# EAGLE schematic headstage-neuropix-64 (EAGLE 9.4.2)
DESIGNER: JON NEWMAN, JAKOB VOIGTS; DESIGN_NAME: HEADSTAGE-64; LICENSE: CERN OHL v1.2; REVISION: 1.2
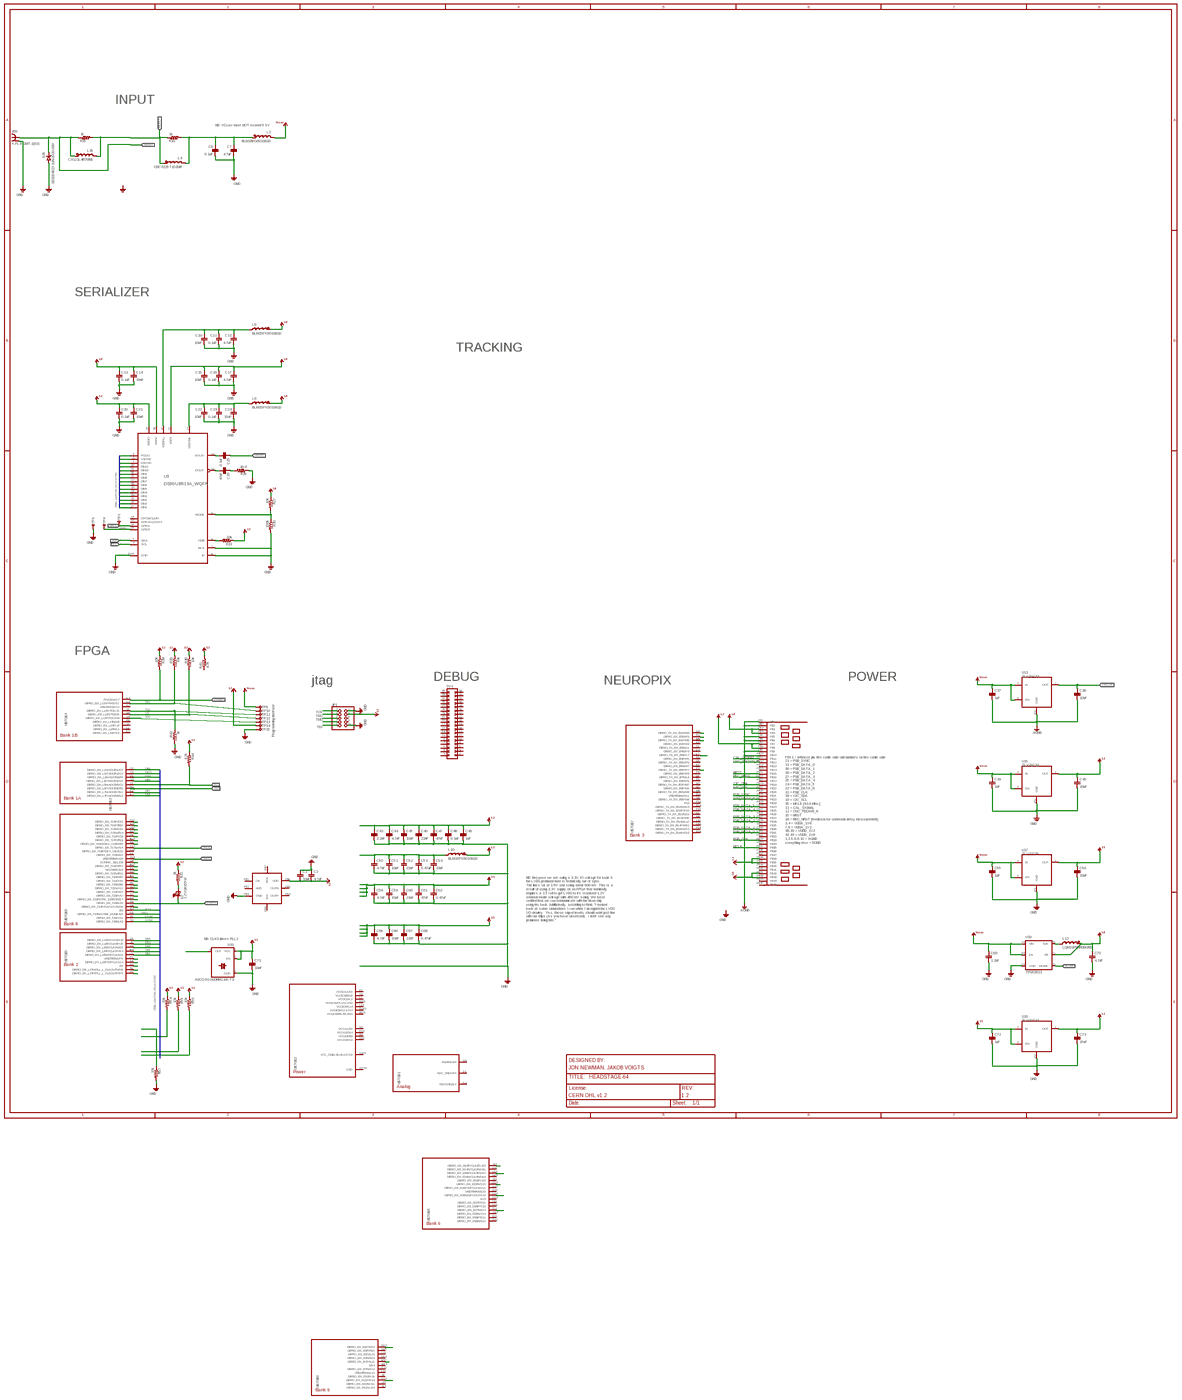
[diagram p0: schematic, sheet 1, overview]
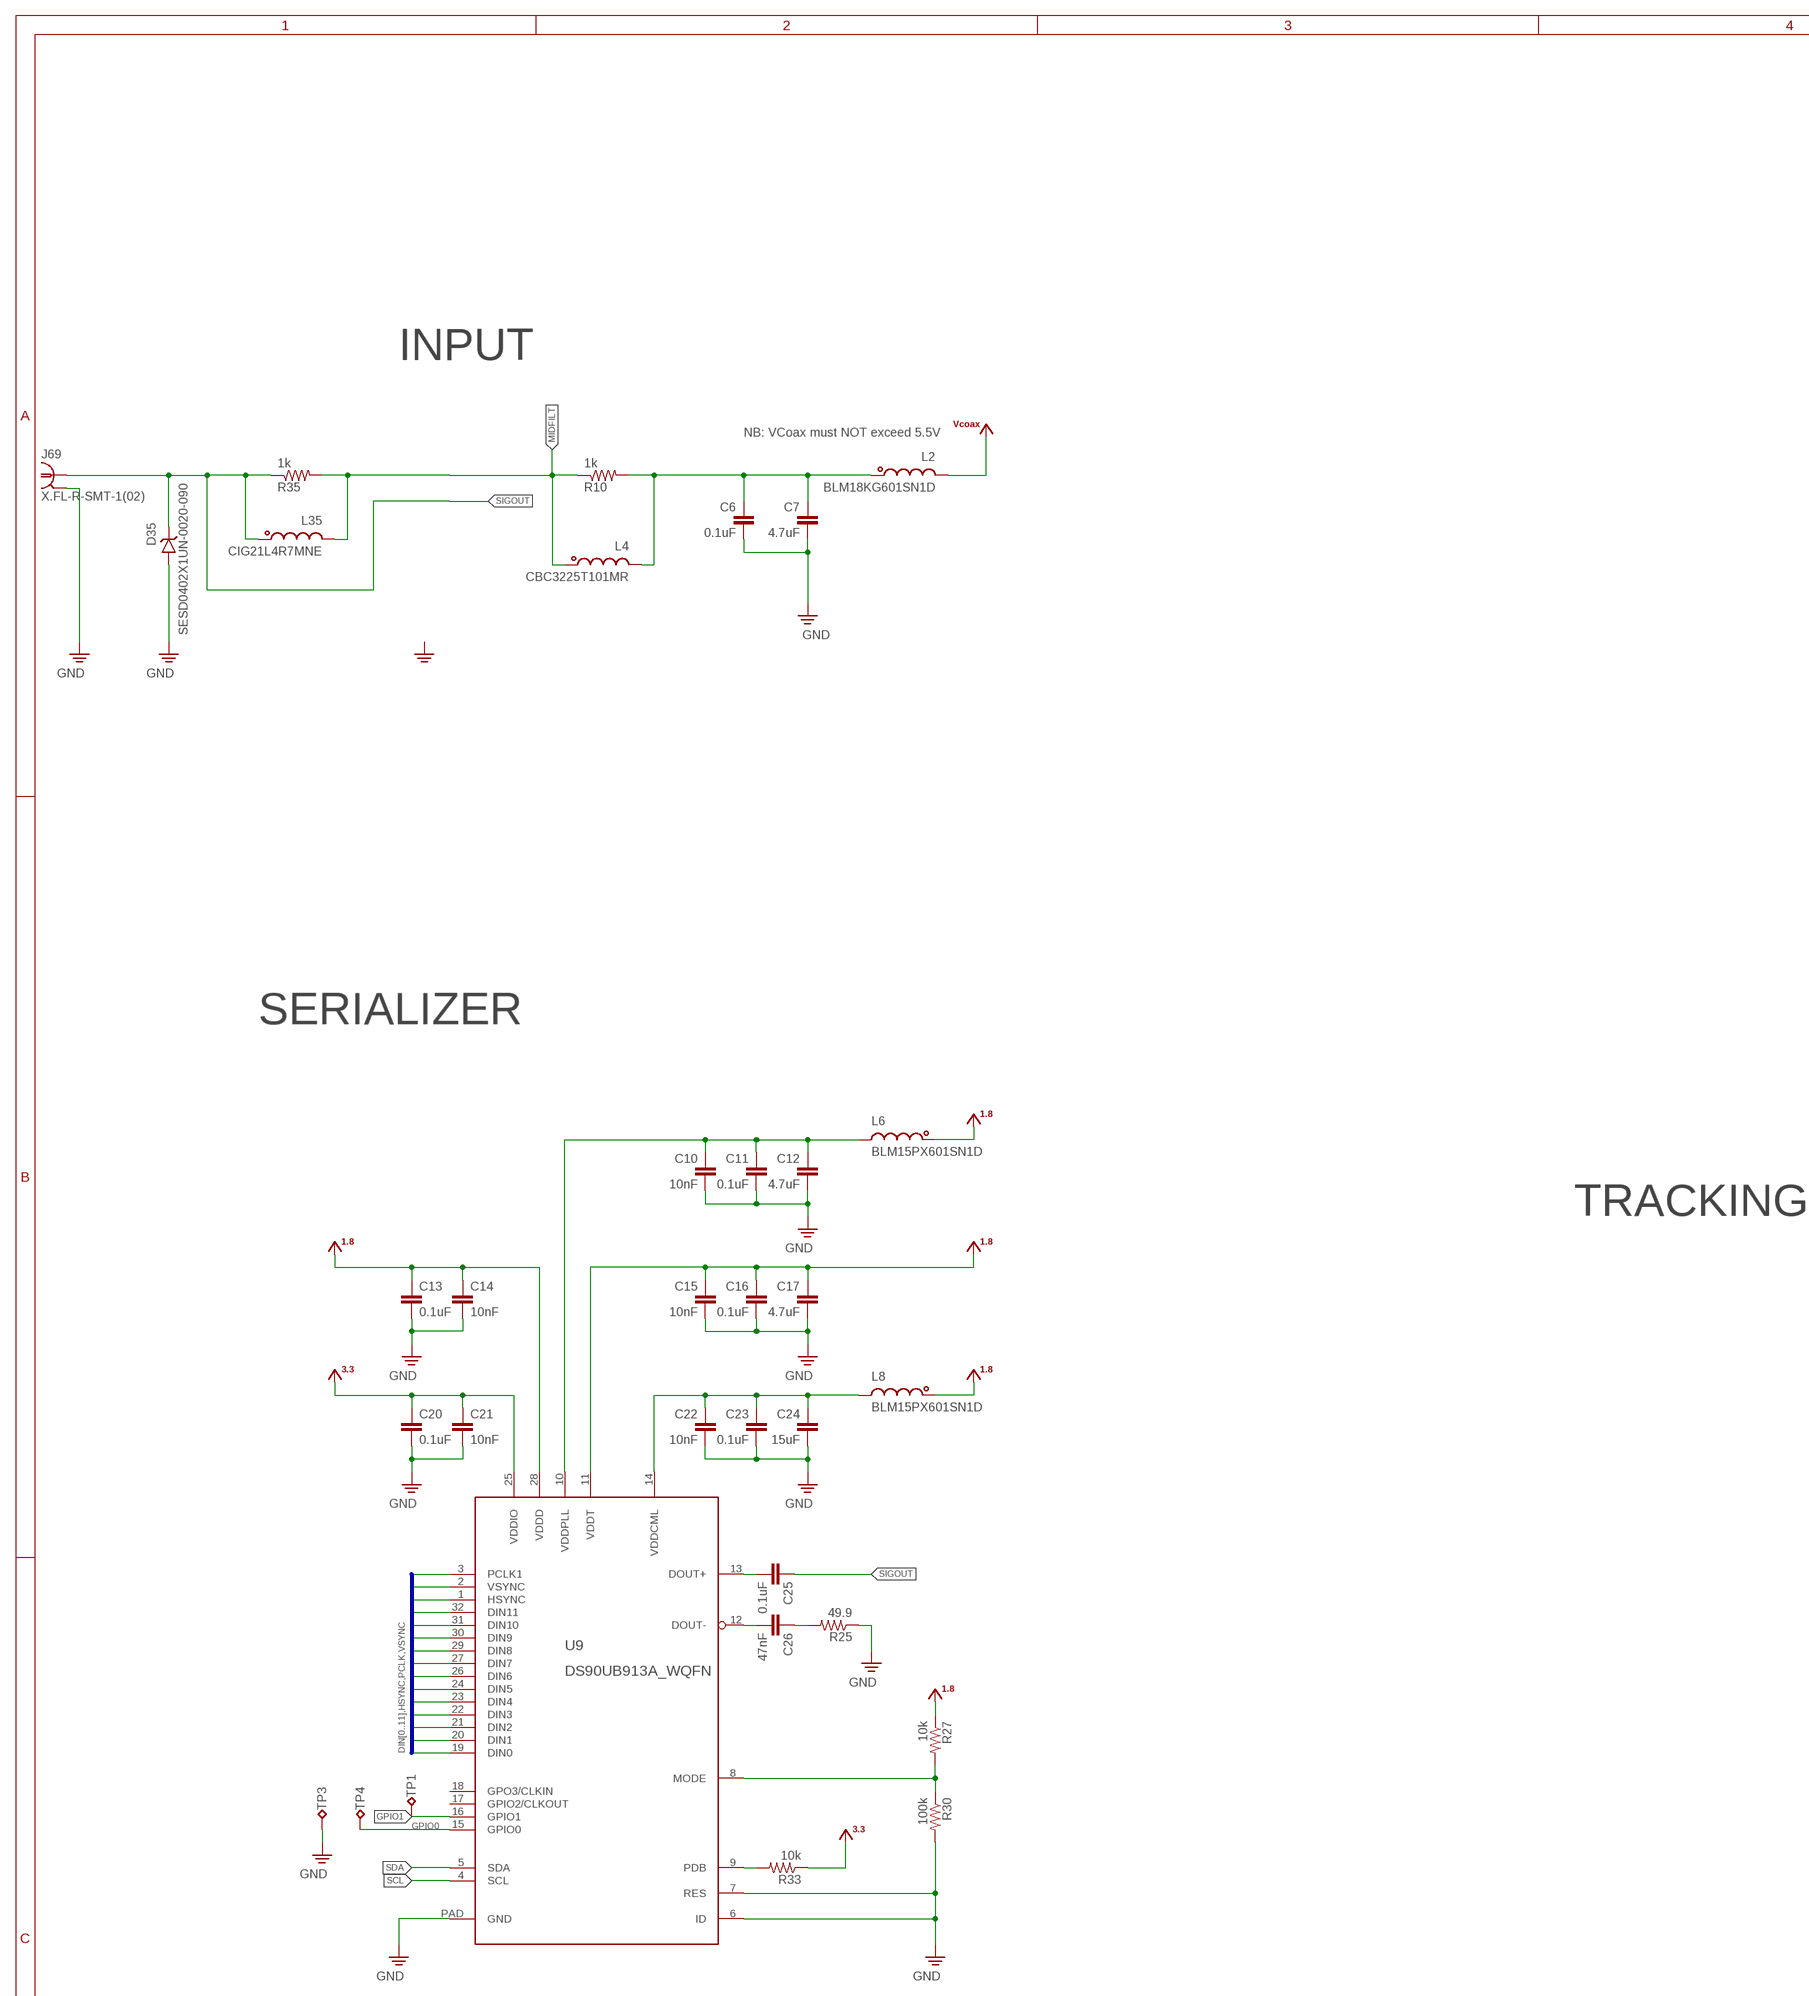
[diagram p1: schematic, sheet 1, part 1 of 5]
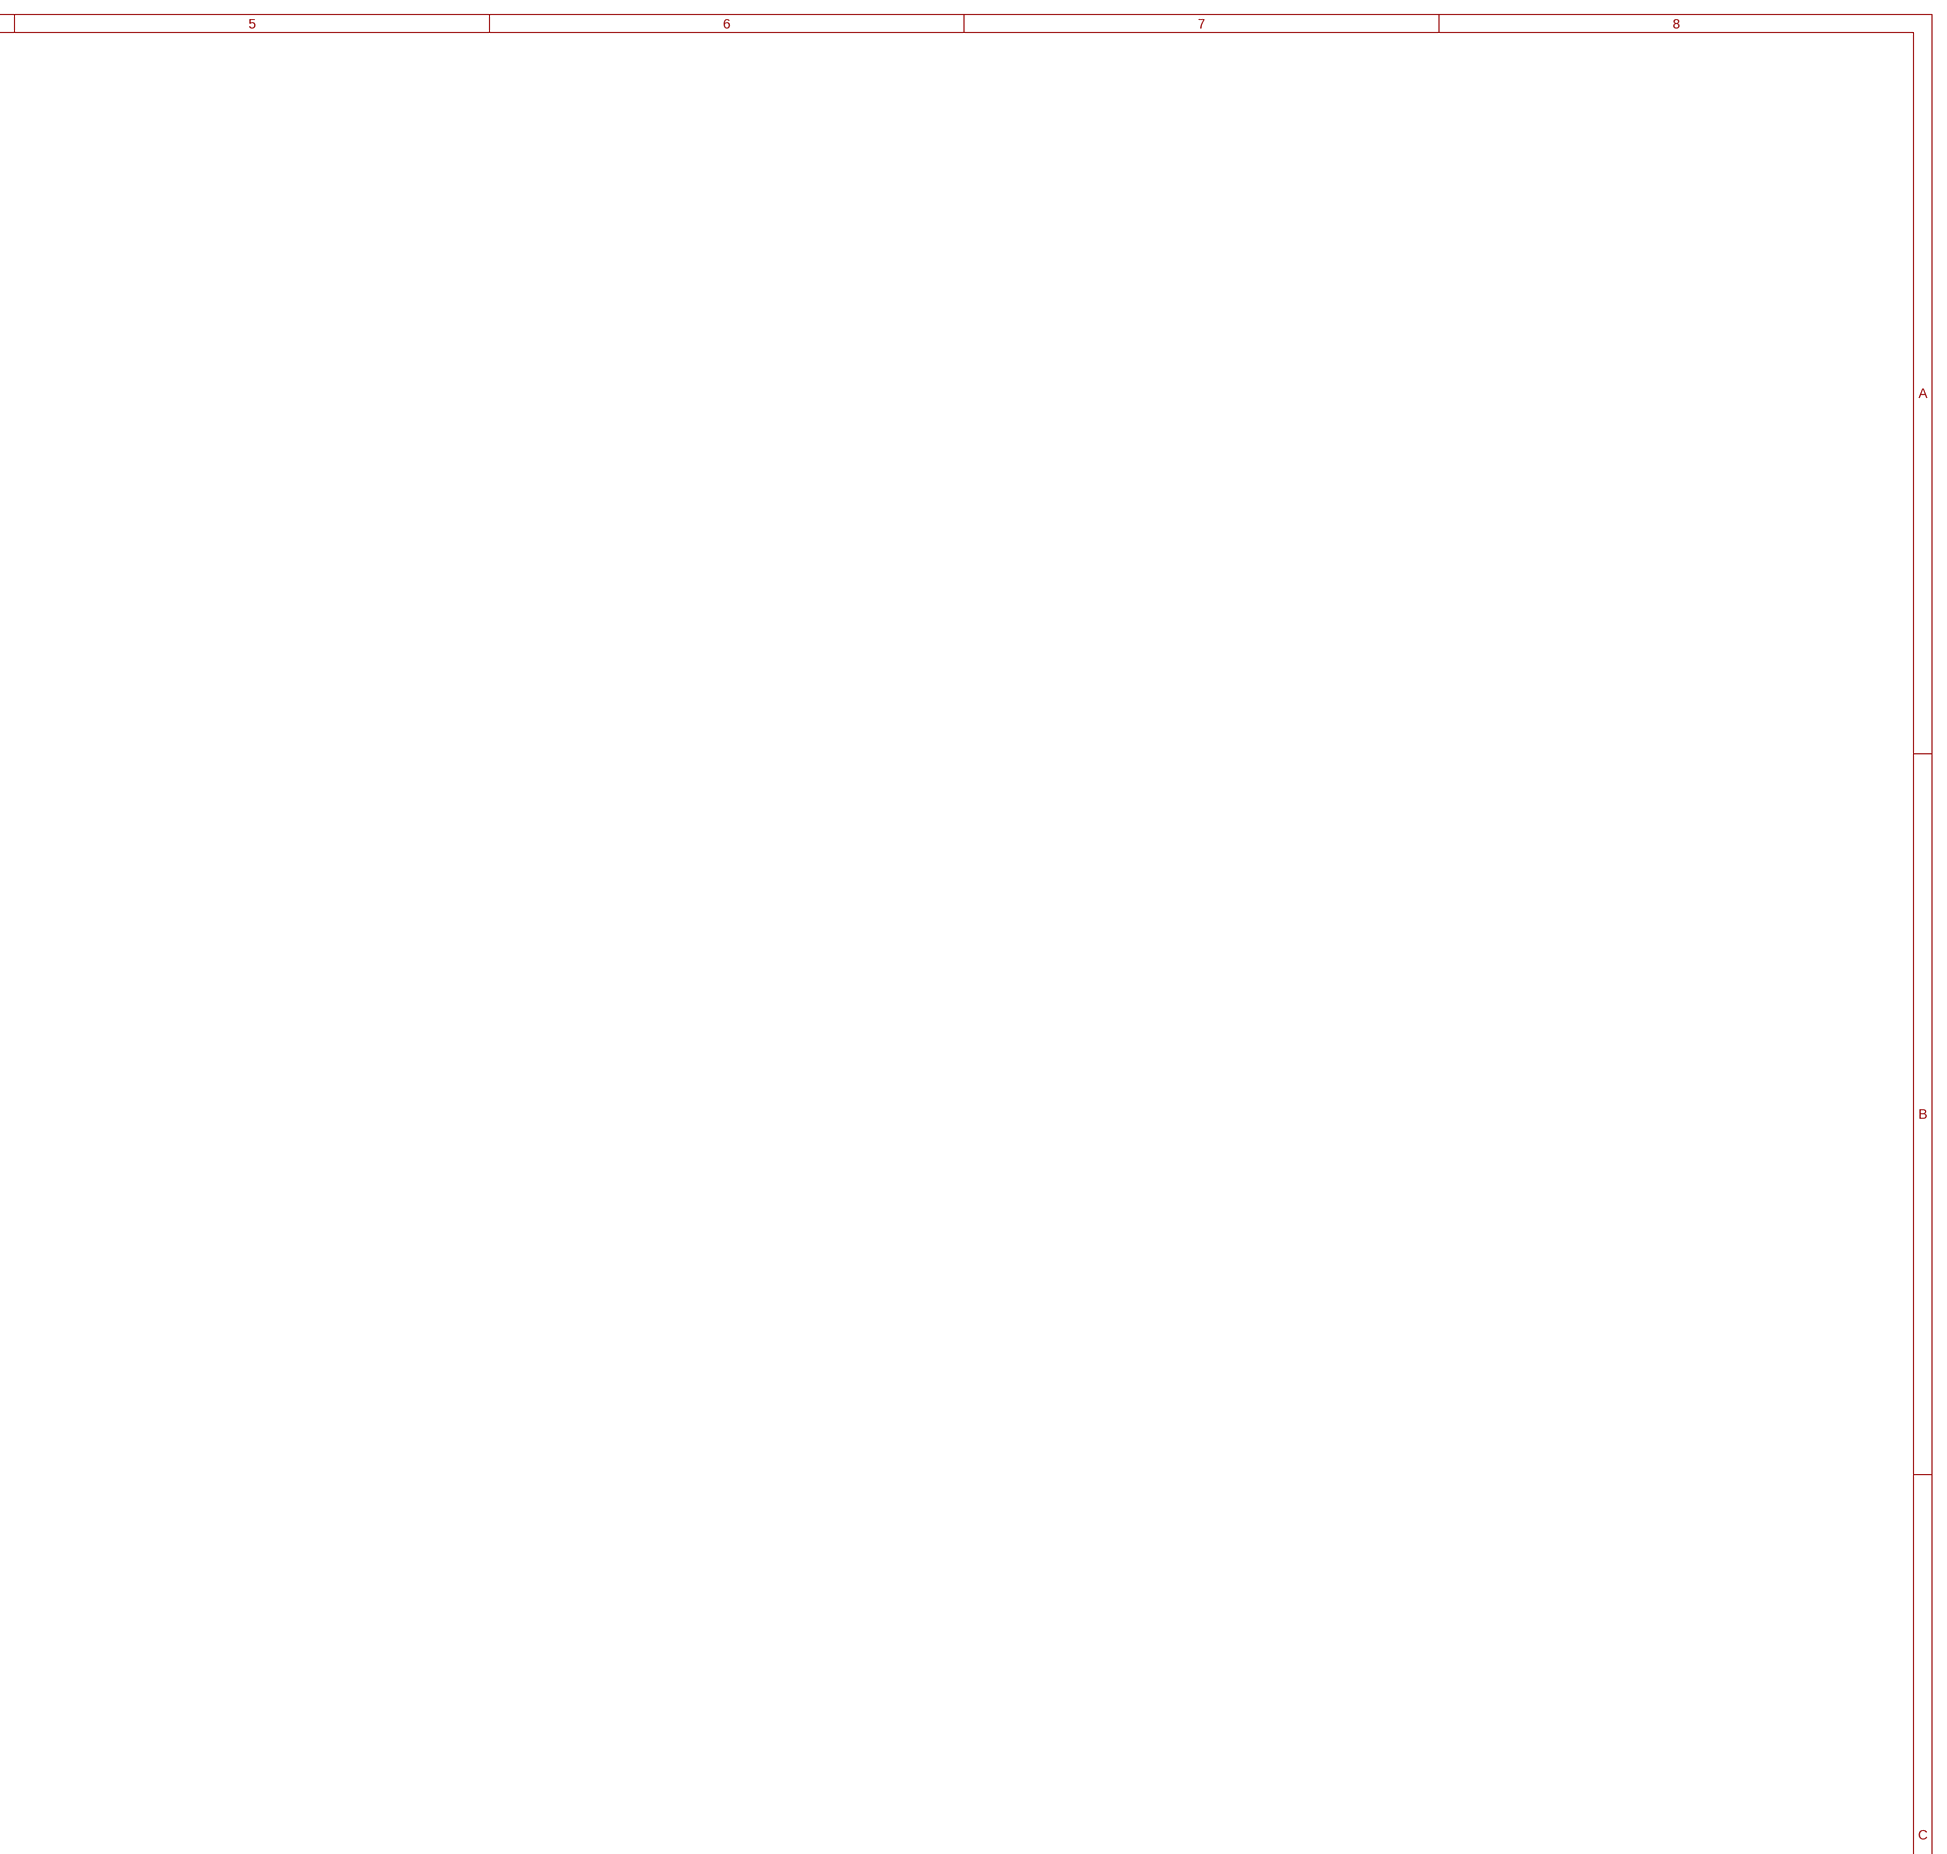
[diagram p2: schematic, sheet 1, part 2 of 5]
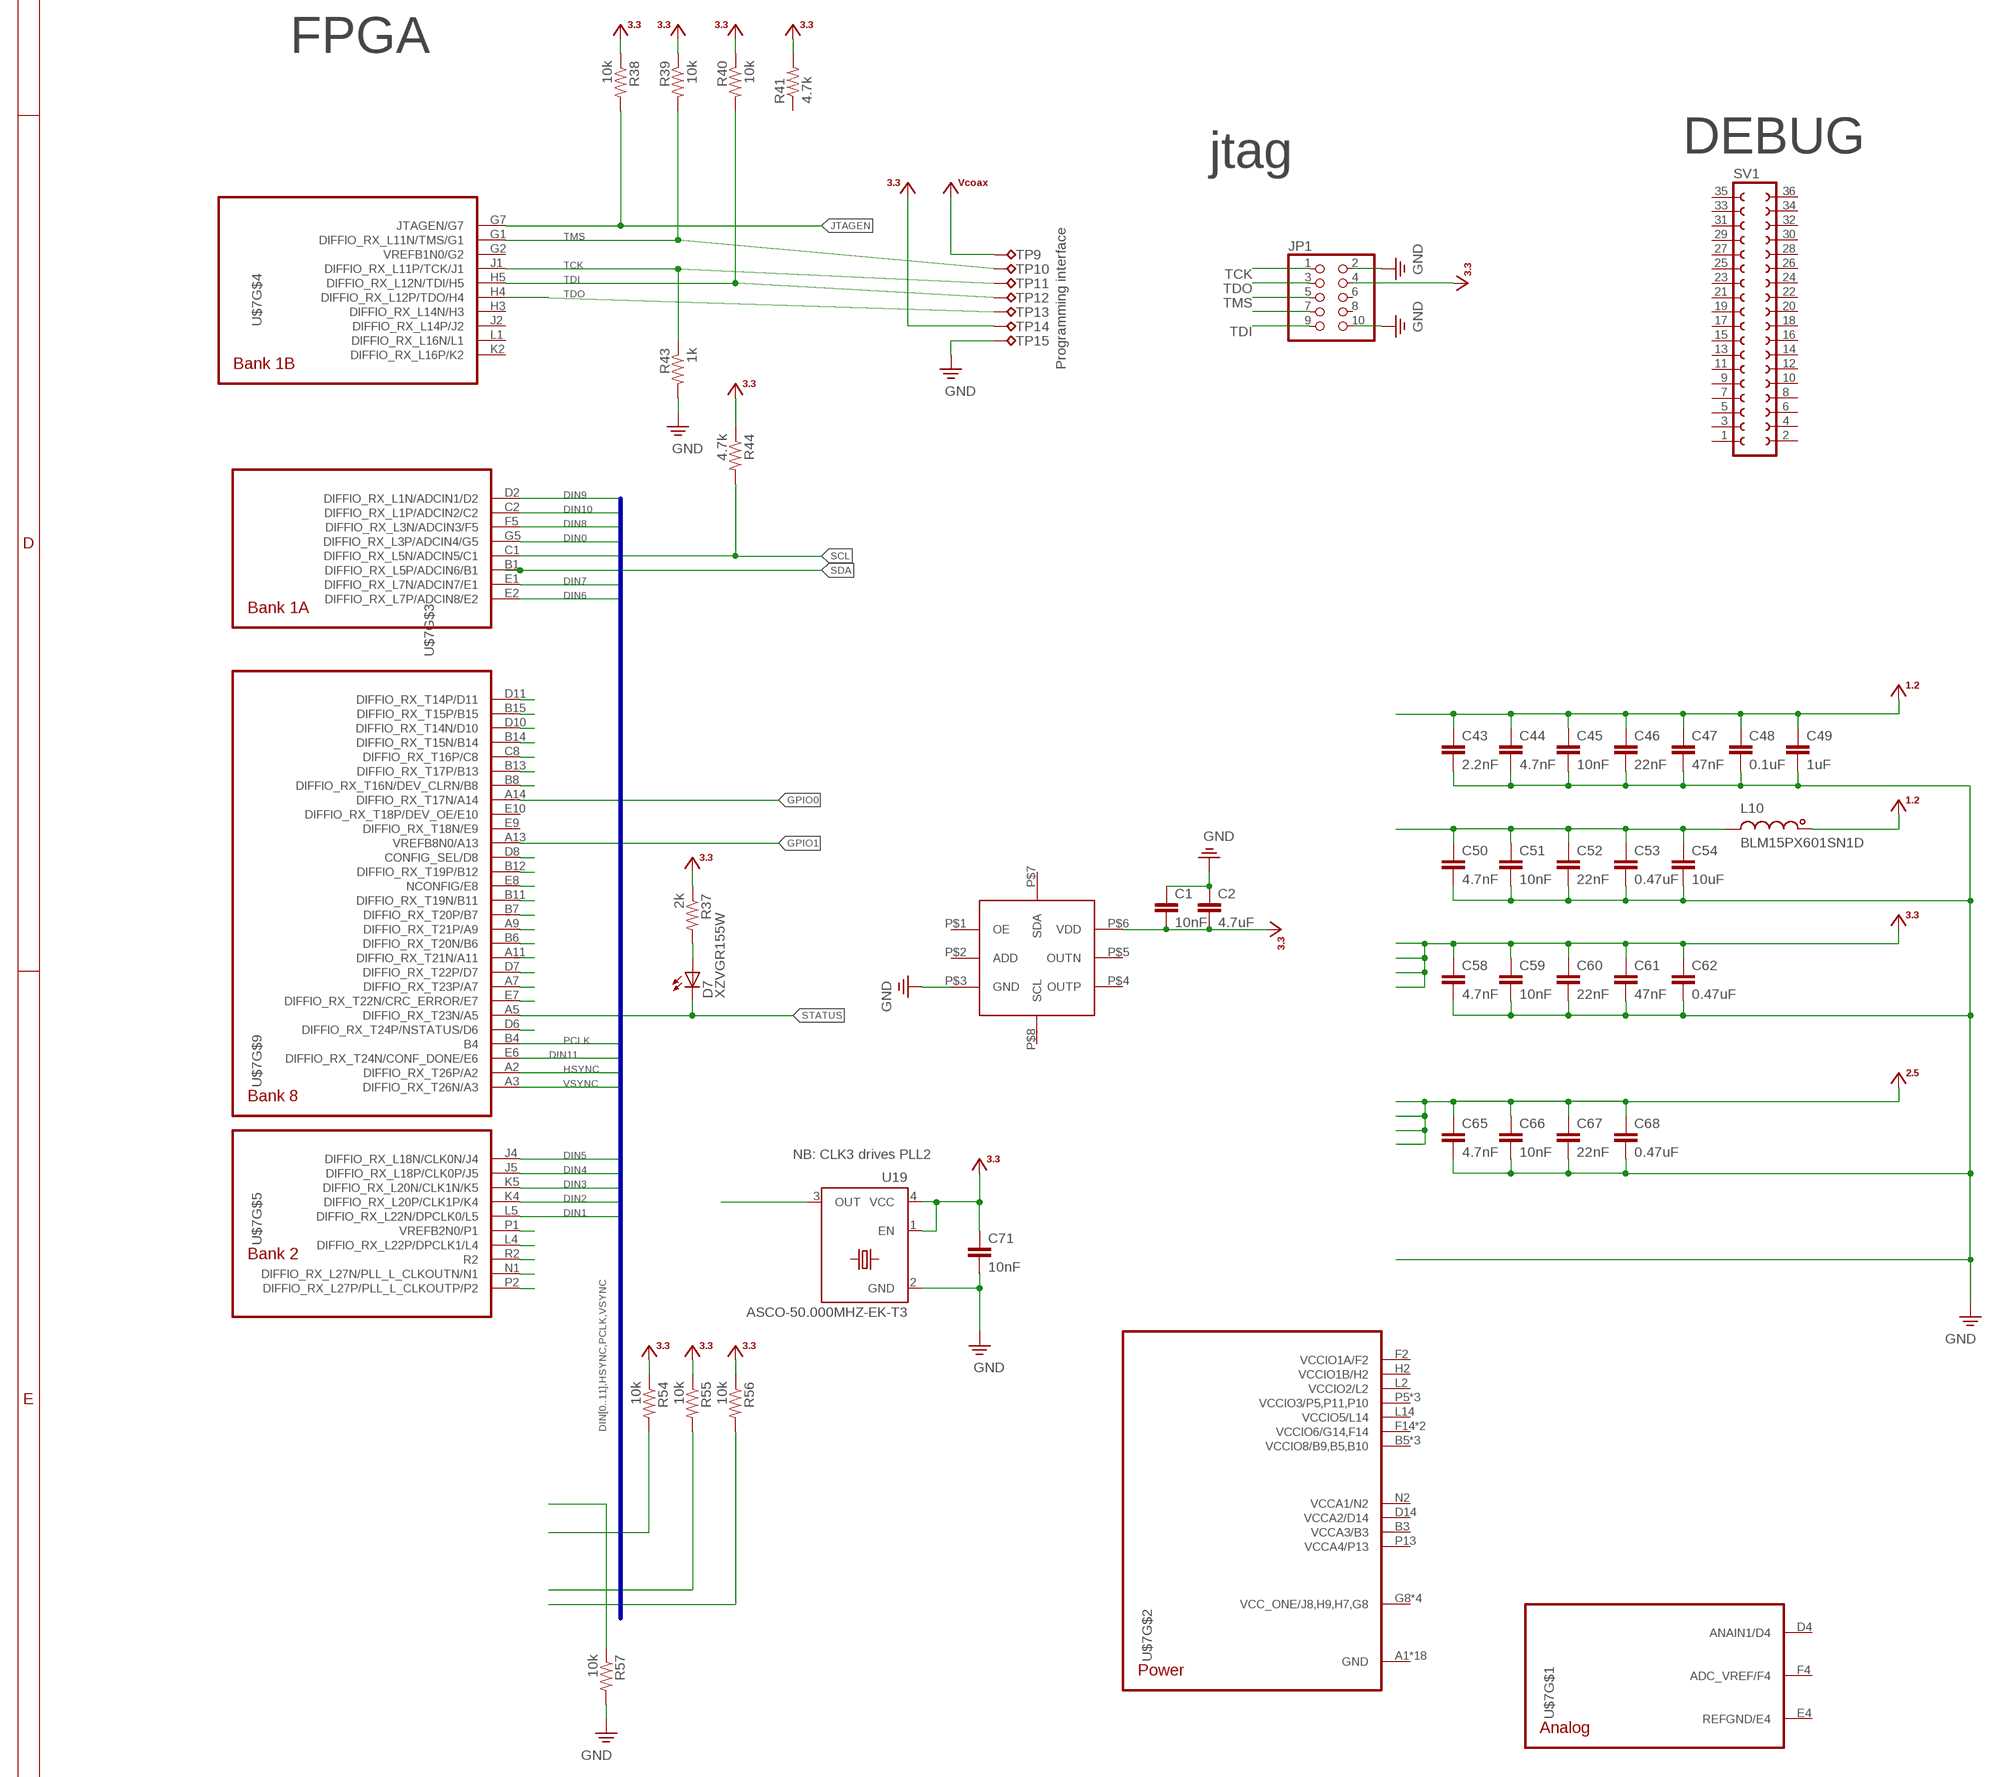
[diagram p3: schematic, sheet 1, part 3 of 5]
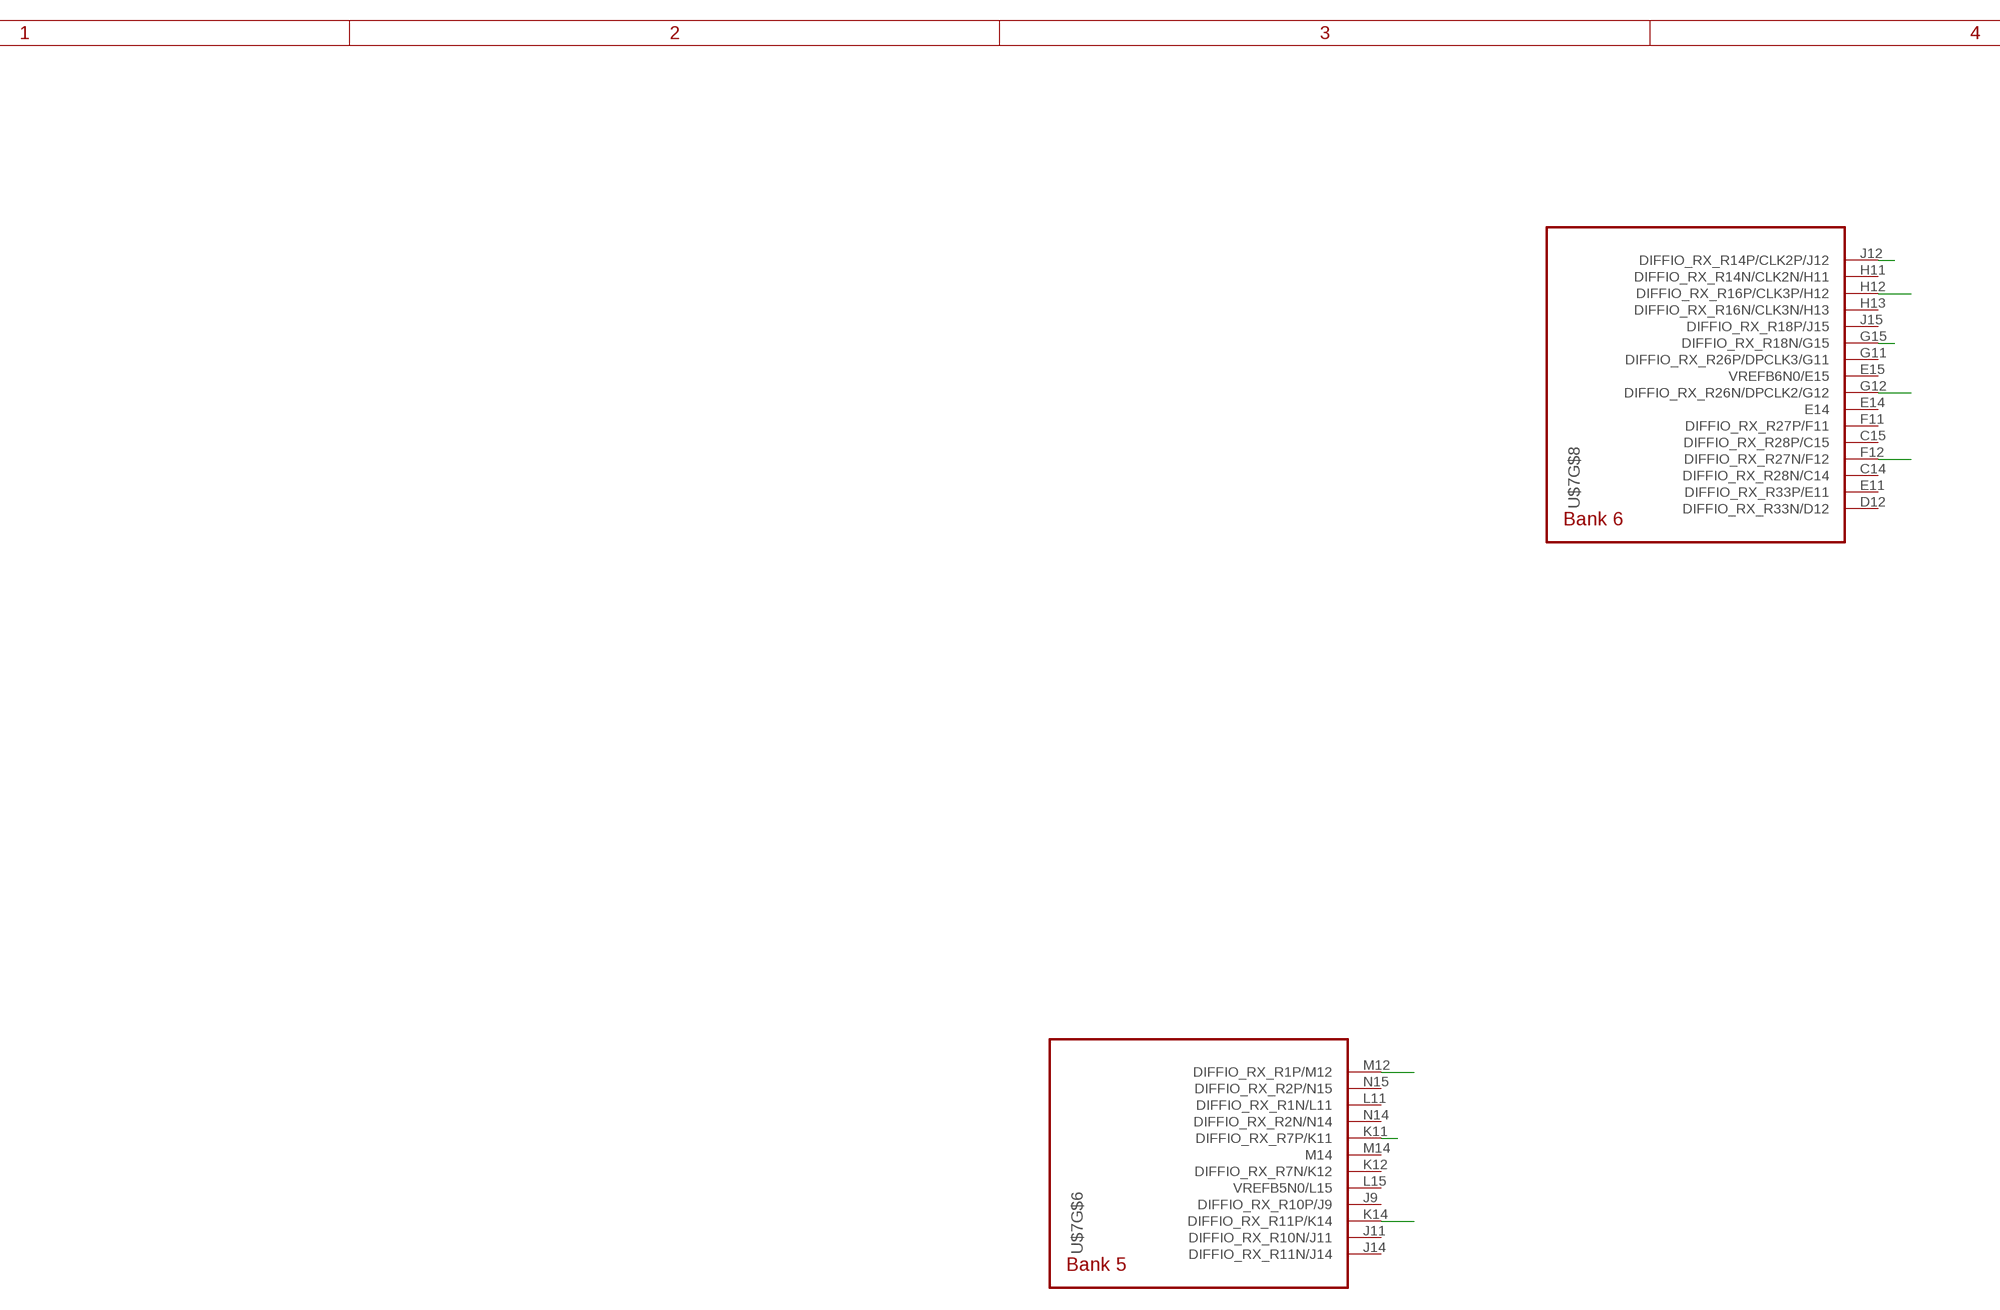
[diagram p4: schematic, sheet 1, part 4 of 5]
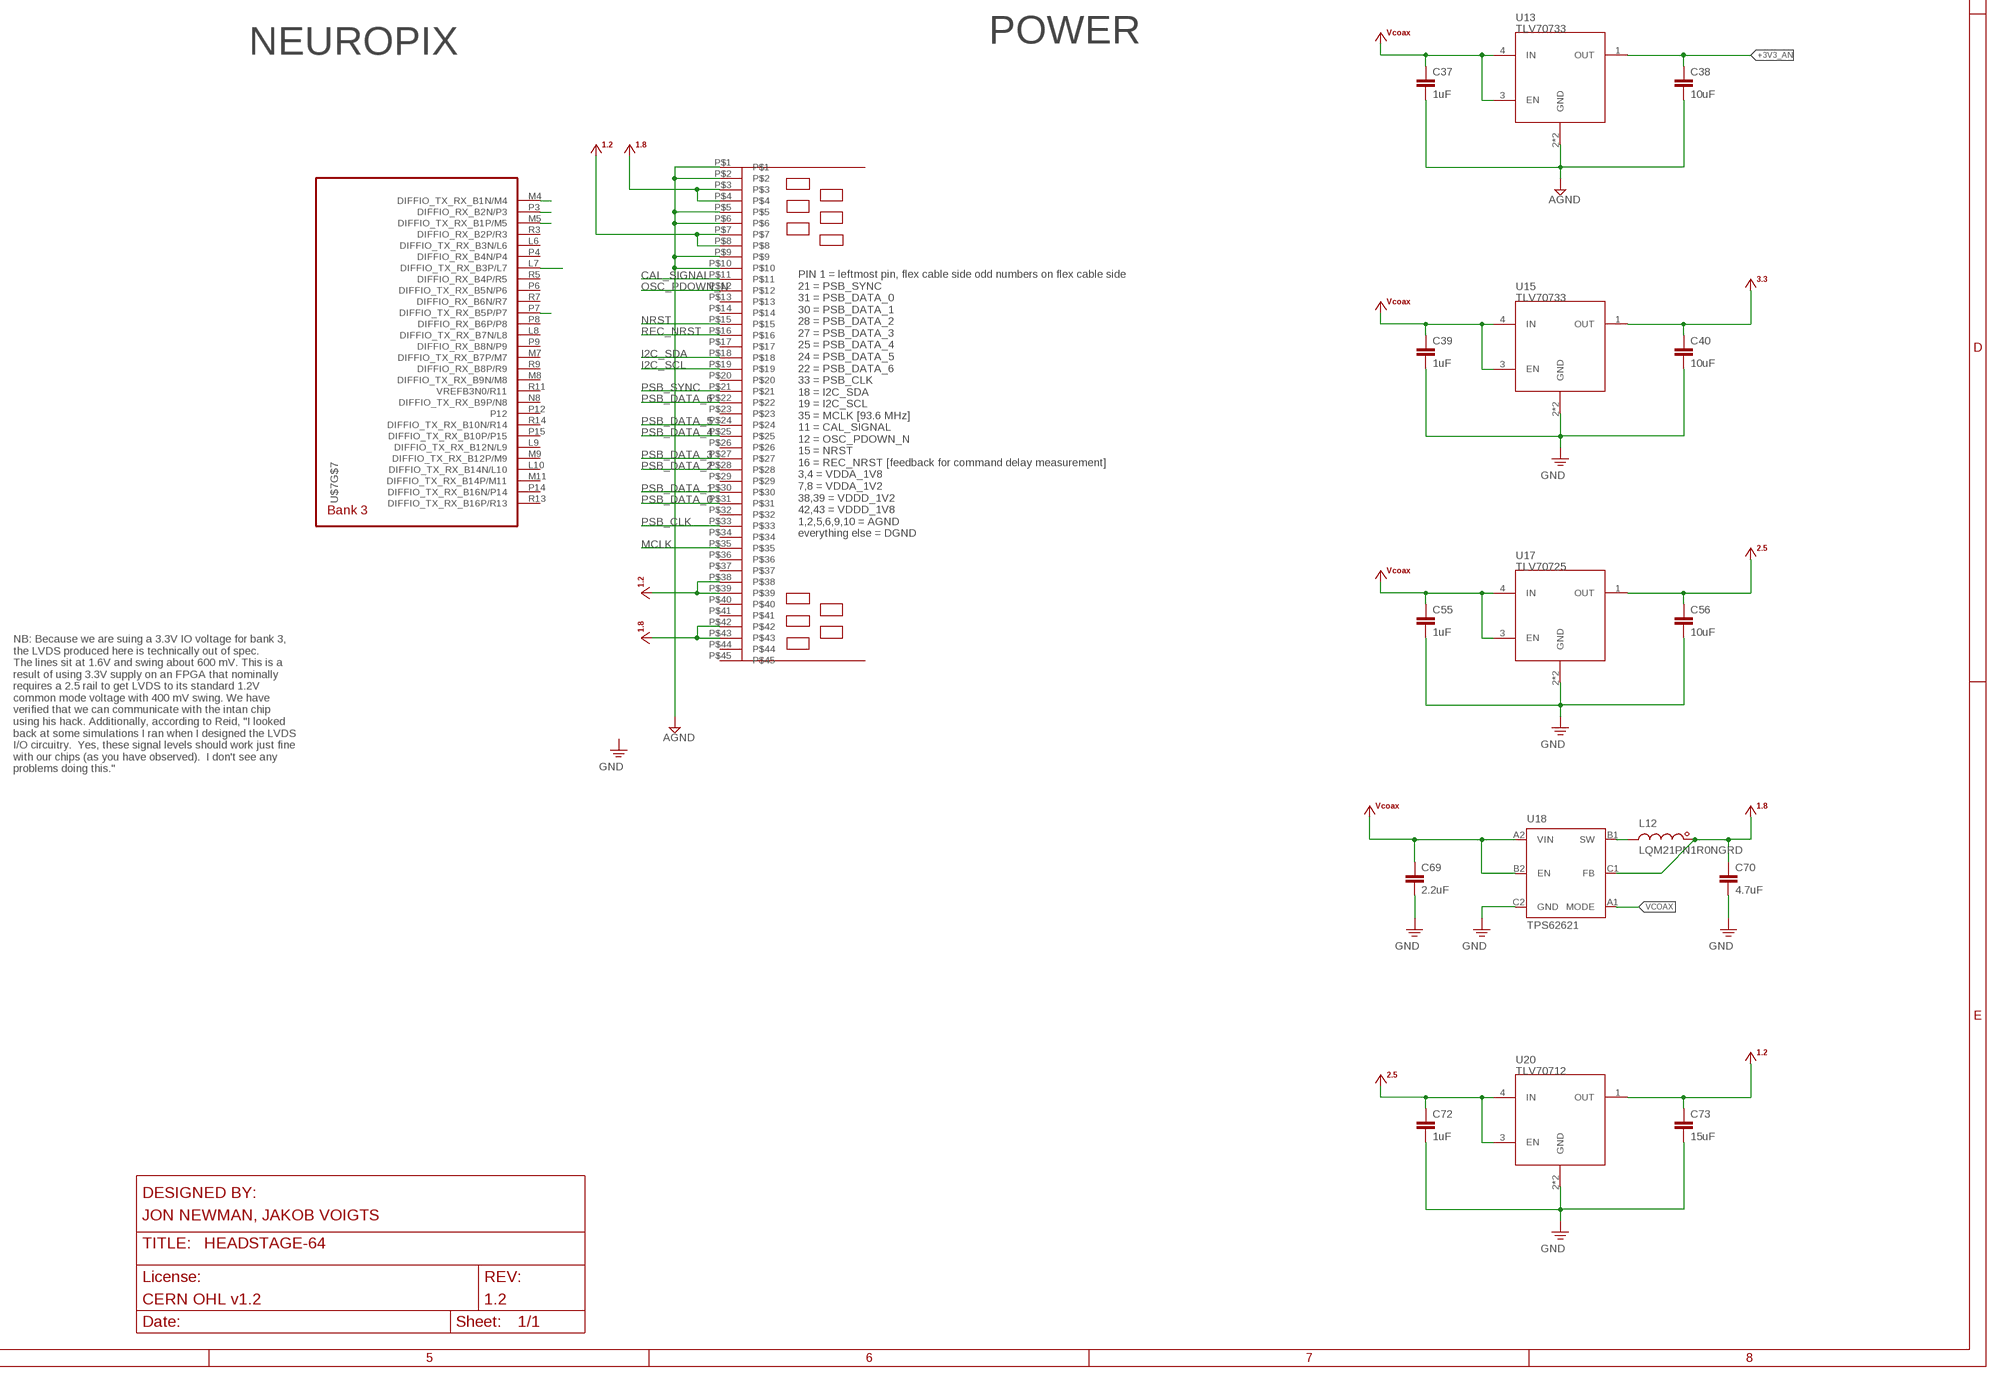
[diagram p5: schematic, sheet 1, part 5 of 5]

## Parts
C1  10nF  C_0201T  [0201T]
C2  4.7uF  C_0402T  [0402T]
C6  0.1uF  C_0201T  [0201T]
C7  4.7uF  C_0402T  [0402T]
C10  10nF  C_0201T  [0201T]
C11  0.1uF  C_0201T  [0201T]
C12  4.7uF  C_0402T  [0402T]
C13  0.1uF  C_0201T  [0201T]
C14  10nF  C_0201T  [0201T]
C15  10nF  C_0201T  [0201T]
C16  0.1uF  C_0201T  [0201T]
C17  4.7uF  C_0402T  [0402T]
C20  0.1uF  C_0201T  [0201T]
C21  10nF  C_0201T  [0201T]
C22  10nF  C_0201T  [0201T]
C23  0.1uF  C_0201T  [0201T]
C24  15uF  C_0402T  [0402T]
C25  0.1uF  C_0201T  [0201T]
C26  47nF  C_0201T  [0201T]
C37  1uF  C_0402T  [0402T]
C38  10uF  C_0402T  [0402T]
C39  1uF  C_0402T  [0402T]
C40  10uF  C_0402T  [0402T]
C43  2.2nF  C_0201T  [0201T]
C44  4.7nF  C_0201T  [0201T]
C45  10nF  C_0201T  [0201T]
C46  22nF  C_0201T  [0201T]
C47  47nF  C_0201T  [0201T]
C48  0.1uF  C_0201T  [0201T]
C49  1uF  C_0201T  [0201T]
C50  4.7nF  C_0201T  [0201T]
C51  10nF  C_0201T  [0201T]
C52  22nF  C_0201T  [0201T]
C53  0.47uF  C_0201T  [0201T]
C54  10uF  C_0402T  [0402T]
C55  1uF  C_0402T  [0402T]
C56  10uF  C_0402T  [0402T]
C58  4.7nF  C_0201T  [0201T]
C59  10nF  C_0201T  [0201T]
C60  22nF  C_0201T  [0201T]
C61  47nF  C_0201T  [0201T]
C62  0.47uF  C_0201T  [0201T]
C65  4.7nF  C_0201T  [0201T]
C66  10nF  C_0201T  [0201T]
C67  22nF  C_0201T  [0201T]
C68  0.47uF  C_0201T  [0201T]
C69  2.2uF  C_0402T  [0402T]
C70  4.7uF  C_0402T  [0402T]
C71  10nF  C_0201T  [0201T]
C72  1uF  C_0402T  [0402T]
C73  15uF  C_0402T  [0402T]
D7  XZVGR155W  LED_0201T  [LED-0201T]
D35  SESD0402X1UN-0020-090  Z-DIODE_0402T-DFN  [0402T-DFN]
J69  X.FL-R-SMT-1(02)  COAX_XFL  [X_FL_R_SMT_1(02)]
JP1  PINHD-2X5  [2X05]
L2  BLM18KG601SN1D  L_0603T  [0603T]
L4  CBC3225T101MR  L_1210T  [1210T]
L6  BLM15PX601SN1D  L_0402T  [0402T]
L8  BLM15PX601SN1D  L_0402T  [0402T]
L10  BLM15PX601SN1D  L_0402T  [0402T]
L12  LQM21PN1R0NGRD  L_0805T  [0805T]
L35  CIG21L4R7MNE  L_0805T  [0805T]
R10  1k  R_0201T  [0201T]
R25  49.9  R_0201T  [0201T]
R27  10k  R_0201T  [0201T]
R30  100k  R_0201T  [0201T]
R33  10k  R_0201T  [0201T]
R35  1k  R_0201T  [0201T]
R37  2k  R_0201T  [0201T]
R38  10k  R_0201T  [0201T]
R39  10k  R_0201T  [0201T]
R40  10k  R_0201T  [0201T]
R41  4.7k  R_0201T  [0201T]
R43  1k  R_0201T  [0201T]
R44  4.7k  R_0201T  [0201T]
R54  10k  R_0201T  [0201T]
R55  10k  R_0201T  [0201T]
R56  10k  R_0201T  [0201T]
R57  10k  R_0201T  [0201T]
SV1  FE18-2  [FE18-2]
TP1  TPTP09R  [TP09R]
TP3  TPTP09R  [TP09R]
TP4  TPTP09R  [TP09R]
TP9  TPTP06R  [TP06R]
TP10  TPTP06R  [TP06R]
TP11  TPTP06R  [TP06R]
TP12  TPTP06R  [TP06R]
TP13  TPTP06R  [TP06R]
TP14  gnd  TPTP06R  [TP06R]
TP15  VCC  TPTP06R  [TP06R]
U9  DS90UB913A_WQFN  [WQFN32-5X5]
U13  TLV70733  TLV707  [X2SON]
U15  TLV70733  TLV707  [X2SON]
U17  TLV70725  TLV707  [X2SON]
U18  TPS62621  TPS6262X  [XBGA6_1.2X0.8]
U19  ASCO-50.000MHZ-EK-T3  CRYSTAL-OSC_ASCO  [ASCO]
U20  TLV70712  TLV707  [X2SON]
U$2  CONNFPCBOTTOM45POS0.30MMR/A  [FH23-45S-0.3SHW(05)]
U$3  LMK61E2  [QFM8]
U$7  10M08SAM153_MBGA  [MBGA153-8X8]

## Nets
$N324: C50.1 C51.1 C52.1 C53.1 C54.1 L10.2
+1V2: C43.1 C44.1 C45.1 C46.1 C47.1 C48.1 C49.1 C73.1 L10.1 U20.1(OUT) U$2.P$7 U$2.P$8 U$2.P$38 U$2.P$39
+1V8: C13.1 C14.1 C15.1 C16.1 C17.1 C70.1 L6.1 L8.1 L12.1 R27.1 U9.11(VDDT) U9.28(VDDD) U18.C1(FB) U$2.P$3 U$2.P$4 U$2.P$42 U$2.P$43
+2V5: C56.1 C65.1 C66.1 C67.1 C68.1 C72.1 U17.1(OUT) U20.3(EN) U20.4(IN)
+3V3: C1.2 C2.2 C20.1 C21.1 C40.1 C58.1 C59.1 C60.1 C61.1 C62.1 C71.1 JP1.4 R33.1 R37.1 R38.1 R39.1 R40.1 R41.2 R44.1 R54.1 R55.1 R56.1 TP14.TP U9.25(VDDIO) U15.1(OUT) U19.1(EN) U19.4(VCC) U$3.P$6(VDD)
+3V3_AN: C38.1 U13.1(OUT)
AGND: C37.2 C38.2 U13.2(GND) U13.PAD(GND) U$2.P$1 U$2.P$2 U$2.P$5 U$2.P$6 U$2.P$9 U$2.P$10
CAL_SIGNAL: U$2.P$11
CONF_DONE: R56.2
CONFIG_SEL: R57.1
DIN0: U9.19(DIN0) U$7.G5(DIFFIO_RX_L3P/ADCIN4/G5)
DIN1: U9.20(DIN1) U$7.L5(DIFFIO_RX_L22N/DPCLK0/L5)
DIN2: U9.21(DIN2) U$7.K4(DIFFIO_RX_L20P/CLK1P/K4)
DIN3: U9.22(DIN3) U$7.K5(DIFFIO_RX_L20N/CLK1N/K5)
DIN4: U9.23(DIN4) U$7.J5(DIFFIO_RX_L18P/CLK0P/J5)
DIN5: U9.24(DIN5) U$7.J4(DIFFIO_RX_L18N/CLK0N/J4)
DIN6: U9.26(DIN6) U$7.E2(DIFFIO_RX_L7P/ADCIN8/E2)
DIN7: U9.27(DIN7) U$7.E1(DIFFIO_RX_L7N/ADCIN7/E1)
DIN8: U9.29(DIN8) U$7.F5(DIFFIO_RX_L3N/ADCIN3/F5)
DIN9: U9.30(DIN9) U$7.D2(DIFFIO_RX_L1N/ADCIN1/D2)
DIN10: U9.31(DIN10) U$7.C2(DIFFIO_RX_L1P/ADCIN2/C2)
DIN11: U9.32(DIN11) U$7.E6(DIFFIO_RX_T24N/CONF_DONE/E6)
GND: C1.1 C2.1 C6.2 C7.2 C10.2 C11.2 C12.2 C13.2 C14.2 C15.2 C16.2 C17.2 C20.2 C21.2 C22.2 C23.2 C24.2 C39.2 C40.2 C43.2 C44.2 C45.2 C46.2 C47.2 C48.2 C49.2 C50.2 C51.2 C52.2 C53.2 C54.2 C55.2 C56.2 C58.2 C59.2 C60.2 C61.2 C62.2 C65.2 C66.2 C67.2 C68.2 C69.2 C70.2 C71.2 C72.2 C73.2 D35.A J69.P$2 J69.P$3 J69.P$4 JP1.2 JP1.10 R25.1 R30.2 R43.2 R57.2 TP3.TP TP15.TP U9.6(ID) U9.7(RES) U9.PAD(GND) U15.2(GND) U15.PAD(GND) U17.2(GND) U17.PAD(GND) U18.C2(GND) U19.2(GND) U20.2(GND) U20.PAD(GND) U$3.P$3(GND)
GPIO0: TP4.TP U9.15(GPIO0) U$7.A14(DIFFIO_RX_T17N/A14)
GPIO1: TP1.TP U9.16(GPIO1) U$7.A13(VREFB8N0/A13)
HSYNC: U9.1(HSYNC) U$7.A2(DIFFIO_RX_T26P/A2)
I2C_SCL: U$2.P$19
I2C_SDA: U$2.P$18
JTAGEN: R38.2 U$7.G7(JTAGEN/G7)
MCLK: U$2.P$35
MIDFILT: L4.1 L35.2 R10.1 R35.2
N$1: U$7.D11(DIFFIO_RX_T14P/D11)
N$2: U$7.B15(DIFFIO_RX_T15P/B15)
N$3: U$7.D10(DIFFIO_RX_T14N/D10)
N$4: JP1.7
N$5: U$7.B14(DIFFIO_RX_T15N/B14)
N$6: U$7.C8(DIFFIO_RX_T16P/C8)
N$7: U$7.B13(DIFFIO_RX_T17P/B13)
N$8: U$7.B8(DIFFIO_RX_T16N/DEV_CLRN/B8)
N$9: U$7.D8(CONFIG_SEL/D8)
N$10: U$7.B12(DIFFIO_RX_T19P/B12)
N$11: U$7.E8(NCONFIG/E8)
N$12: U$7.B11(DIFFIO_RX_T19N/B11)
N$13: C6.1 C7.1 L2.1 L4.2 R10.2
N$14: U$7.B7(DIFFIO_RX_T20P/B7)
N$15: U$7.A9(DIFFIO_RX_T21P/A9)
N$16: U$7.B6(DIFFIO_RX_T20N/B6)
N$17: U$7.A11(DIFFIO_RX_T21N/A11)
N$18: U$7.D7(DIFFIO_RX_T22P/D7)
N$19: U$7.A7(DIFFIO_RX_T23P/A7)
N$20: U$7.E7(DIFFIO_RX_T22N/CRC_ERROR/E7)
N$22: U$7.D6(DIFFIO_RX_T24P/NSTATUS/D6)
N$28: C25.2 U9.13(DOUT+)
N$29: D7.2(A) R37.2
N$30: R33.2 U9.9(PDB)
N$31: C26.2 U9.12(DOUT-)
N$32: C26.1 R25.2
N$33: R27.2 R30.1 U9.8(MODE)
N$34: C10.1 C11.1 C12.1 L6.2 U9.10(VDDPLL)
N$35: C22.1 C23.1 C24.1 L8.2 U9.14(VDDCML)
N$36: U$7.P1(VREFB2N0/P1)
N$37: U19.3(OUT)
N$38: U$7.L4(DIFFIO_RX_L22P/DPCLK1/L4)
N$39: U$7.R2
N$40: U$7.N1(DIFFIO_RX_L27N/PLL_L_CLKOUTN/N1)
N$41: U$7.P2(DIFFIO_RX_L27P/PLL_L_CLKOUTP/P2)
N$42: U$7.M4(DIFFIO_TX_RX_B1N/M4)
N$43: U$7.P3(DIFFIO_RX_B2N/P3)
N$44: U$7.M5(DIFFIO_TX_RX_B1P/M5)
N$45: R54.2
N$46: L12.2 U18.B1(SW)
N$47: U$7.L7(DIFFIO_TX_RX_B3P/L7)
N$48: U$7.P7(DIFFIO_TX_RX_B5P/P7)
N$49: U$7.M12(DIFFIO_RX_R1P/M12)
N$50: U$7.K11(DIFFIO_RX_R7P/K11)
N$51: U$7.K14(DIFFIO_RX_R11P/K14)
N$52: U$7.J12(DIFFIO_RX_R14P/CLK2P/J12)
N$53: U$7.H12(DIFFIO_RX_R16P/CLK3P/H12)
N$54: U$7.G15(DIFFIO_RX_R18N/G15)
N$55: U$7.G12(DIFFIO_RX_R26N/DPCLK2/G12)
N$56: U$7.F12(DIFFIO_RX_R27N/F12)
NRST: U$2.P$15
NSTATUS: R55.2
OSC_PDOWN_N: U$2.P$12
PCLK: U9.3(PCLK1) U$7.B4
PSB_CLK: U$2.P$33
PSB_DATA_0: U$2.P$31
PSB_DATA_1: U$2.P$30
PSB_DATA_2: U$2.P$28
PSB_DATA_3: U$2.P$27
PSB_DATA_4: U$2.P$25
PSB_DATA_5: U$2.P$24
PSB_DATA_6: U$2.P$22
PSB_SYNC: U$2.P$21
REC_NRST: U$2.P$16
SCL: R44.2 U9.4(SCL) U$7.C1(DIFFIO_RX_L5N/ADCIN5/C1)
SDA: U9.5(SDA) U$7.B1(DIFFIO_RX_L5P/ADCIN6/B1)
SIGOUT: C25.1 D35.C J69.P$1 L35.1 R35.1
STATUS: D7.1(C) U$7.A5(DIFFIO_RX_T23N/A5)
TCK: JP1.1 R43.1 TP11.TP U$7.J1(DIFFIO_RX_L11P/TCK/J1)
TDI: JP1.9 R40.2 TP12.TP U$7.H5(DIFFIO_RX_L12N/TDI/H5)
TDO: JP1.3 TP13.TP U$7.H4(DIFFIO_RX_L12P/TDO/H4)
TMS: JP1.5 R39.2 TP10.TP U$7.G1(DIFFIO_RX_L11N/TMS/G1)
VCOAX: C37.1 C39.1 C55.1 C69.1 L2.2 TP9.TP U13.3(EN) U13.4(IN) U15.3(EN) U15.4(IN) U17.3(EN) U17.4(IN) U18.A1(MODE) U18.A2(VIN) U18.B2(EN) ; supply symbol labelled +VCOAX
VSYNC: U9.2(VSYNC) U$7.A3(DIFFIO_RX_T26N/A3)
Unconnected: JP1.6 JP1.8 R41.1 SV1.1 SV1.2 SV1.3 SV1.4 SV1.5 SV1.6 SV1.7 SV1.8 SV1.9 SV1.10 SV1.11 SV1.12 SV1.13 SV1.14 SV1.15 SV1.16 SV1.17 SV1.18 SV1.19 SV1.20 SV1.21 SV1.22 SV1.23 SV1.24 SV1.25 SV1.26 SV1.27 SV1.28 SV1.29 SV1.30 SV1.31 SV1.32 SV1.33 SV1.34 SV1.35 SV1.36 U9.17(GPIO2/CLKOUT) U9.18(GPO3/CLKIN) U$2.P$13 U$2.P$14 U$2.P$17 U$2.P$20 U$2.P$23 U$2.P$26 U$2.P$29 U$2.P$32 U$2.P$34 U$2.P$36 U$2.P$37 U$2.P$40 U$2.P$41 U$2.P$44 U$2.P$45 U$3.P$1(OE) U$3.P$2(ADD) U$3.P$4(OUTP) U$3.P$5(OUTN) U$3.P$7(SDA) U$3.P$8(SCL) U$7.C14(DIFFIO_RX_R28N/C14) U$7.C15(DIFFIO_RX_R28P/C15) U$7.D4(ANAIN1/D4) U$7.D12(DIFFIO_RX_R33N/D12) U$7.E9(DIFFIO_RX_T18N/E9) U$7.E10(DIFFIO_RX_T18P/DEV_OE/E10) U$7.E11(DIFFIO_RX_R33P/E11) U$7.E14 U$7.E15(VREFB6N0/E15) U$7.F4(ADC_VREF/F4) U$7.F11(DIFFIO_RX_R27P/F11) U$7.G2(VREFB1N0/G2) U$7.G11(DIFFIO_RX_R26P/DPCLK3/G11) U$7.H3(DIFFIO_RX_L14N/H3) U$7.H11(DIFFIO_RX_R14N/CLK2N/H11) U$7.H13(DIFFIO_RX_R16N/CLK3N/H13) U$7.J2(DIFFIO_RX_L14P/J2) U$7.J9(DIFFIO_RX_R10P/J9) U$7.J11(DIFFIO_RX_R10N/J11) U$7.J14(DIFFIO_RX_R11N/J14) U$7.J15(DIFFIO_RX_R18P/J15) U$7.K2(DIFFIO_RX_L16P/K2) U$7.K12(DIFFIO_RX_R7N/K12) U$7.L1(DIFFIO_RX_L16N/L1) U$7.L6(DIFFIO_TX_RX_B3N/L6) U$7.L8(DIFFIO_TX_RX_B7N/L8) U$7.L9(DIFFIO_TX_RX_B12N/L9) U$7.L10(DIFFIO_TX_RX_B14N/L10) U$7.L11(DIFFIO_RX_R1N/L11) U$7.L15(VREFB5N0/L15) U$7.M7(DIFFIO_TX_RX_B7P/M7) U$7.M8(DIFFIO_TX_RX_B9N/M8) U$7.M9(DIFFIO_TX_RX_B12P/M9) U$7.M11(DIFFIO_TX_RX_B14P/M11) U$7.M14 U$7.N8(DIFFIO_TX_RX_B9P/N8) U$7.N14(DIFFIO_RX_R2N/N14) U$7.N15(DIFFIO_RX_R2P/N15) U$7.P4(DIFFIO_RX_B4N/P4) U$7.P6(DIFFIO_TX_RX_B5N/P6) U$7.P8(DIFFIO_RX_B6P/P8) U$7.P9(DIFFIO_RX_B8N/P9) U$7.P12 U$7.P14(DIFFIO_TX_RX_B16N/P14) U$7.P15(DIFFIO_TX_RX_B10P/P15) U$7.R3(DIFFIO_RX_B2P/R3) U$7.R5(DIFFIO_RX_B4P/R5) U$7.R7(DIFFIO_RX_B6N/R7) U$7.R9(DIFFIO_RX_B8P/R9) U$7.R11(VREFB3N0/R11) U$7.R13(DIFFIO_TX_RX_B16P/R13) U$7.R14(DIFFIO_TX_RX_B10N/R14)

## Buses
DIN[0..11],HSYNC,PCLK,VSYNC

## Notes on the sheet
- INPUT
- NB: VCoax must NOT exceed 5.5V
- SERIALIZER
- TRACKING
- FPGA
- jtag | DEBUG | NEUROPIX | POWER
- Programming interface
- PIN 1 = leftmost pin, flex cable side odd numbers on flex cable side
  21 = PSB_SYNC 
  31 = PSB_DATA_0 
  30 = PSB_DATA_1 
  28 = PSB_DATA_2 
  27 = PSB_DATA_3 
  25 = PSB_DATA_4 
  24 = PSB_DATA_5 
  22 = PSB_DATA_6 
  33 = PSB_CLK
  18 = I2C_SDA 
  19 = I2C_SCL
  35 = MCLK [93.6 MHz]
  11 = CAL_SIGNAL 
  12 = OSC_PDOWN_N 
  15 = NRST 
  16 = REC_NRST [feedback for command delay measurement]
  3,4 = VDDA_1V8 
  7,8 = VDDA_1V2
  38,39 = VDDD_1V2 
  42,43 = VDDD_1V8
  1,2,5,6,9,10 = AGND 
  everything else = DGND
- NB: Because we are suing a 3.3V IO voltage for bank 3,
  the LVDS produced here is technically out of spec.
  The lines sit at 1.6V and swing about 600 mV. This is a
  result of using 3.3V supply on an FPGA that nominally
  requires a 2.5 rail to get LVDS to its standard 1.2V
  common mode voltage with 400 mV swing. We have
  verified that we can communicate with the intan chip
  using his hack. Additionally, according to Reid, "I looked
  back at some simulations I ran when I designed the LVDS
  I/O circuitry.  Yes, these signal levels should work just fine
  with our chips (as you have observed).  I don't see any
  problems doing this."
- NB: CLK3 drives PLL2

## Power pins joined to a net without a drawn wire
GND: U$7.A1(GND) U$7.A15(GND) U$7.B2(GND) U$7.D5(GND) U$7.D9(GND) U$7.E5(GND) U$7.E12(GND) U$7.G4(GND) U$7.G9(GND) U$7.H8(GND) U$7.H14(GND) U$7.J7(GND) U$7.L12(GND) U$7.M2(GND) U$7.M6(GND) U$7.M10(GND) U$7.R1(GND) U$7.R15(GND)
REFGND/E4: U$7.E4(REFGND/E4)
VCC_ONE/J8,H9,H7,G8: U$7.G8(VCC_ONE/J8,H9,H7,G8) U$7.H7(VCC_ONE/J8,H9,H7,G8) U$7.H9(VCC_ONE/J8,H9,H7,G8) U$7.J8(VCC_ONE/J8,H9,H7,G8)
VCCA1/N2: U$7.N2(VCCA1/N2)
VCCA2/D14: U$7.D14(VCCA2/D14)
VCCA3/B3: U$7.B3(VCCA3/B3)
VCCA4/P13: U$7.P13(VCCA4/P13)
VCCIO1A/F2: U$7.F2(VCCIO1A/F2)
VCCIO1B/H2: U$7.H2(VCCIO1B/H2)
VCCIO2/L2: U$7.L2(VCCIO2/L2)
VCCIO3/P5,P11,P10: U$7.P5(VCCIO3/P5,P11,P10) U$7.P10(VCCIO3/P5,P11,P10) U$7.P11(VCCIO3/P5,P11,P10)
VCCIO5/L14: U$7.L14(VCCIO5/L14)
VCCIO6/G14,F14: U$7.F14(VCCIO6/G14,F14) U$7.G14(VCCIO6/G14,F14)
VCCIO8/B9,B5,B10: U$7.B5(VCCIO8/B9,B5,B10) U$7.B9(VCCIO8/B9,B5,B10) U$7.B10(VCCIO8/B9,B5,B10)

## Library data of the parts
C1 C10 C11 C13-C16 C20-C23 C43-C48 C50-C52 C58-C61 C65-C67 C71 = jonnew:C: Capacitor
C2 C37 C39 C55 C69 C70 C72 = jonnew:C: Capacitor; PARTNO: CL05A105KO5NNNC
C6 = jonnew:C: Capacitor; PARTNO: C0603X5R1C104K030BC
C7 = jonnew:C: Capacitor; PARTNO: CL05A475MO5NUNC
C12 C17 = jonnew:C: Capacitor; PARTNO: GRM155R61A475MEAAD
C24 = jonnew:C: Capacitor; PARTNO: CL05A226MQ5QUNC
C25 = jonnew:C: Capacitor; PARTNO: C1005X7R1H104K050BB
C26 = jonnew:C: Capacitor; PARTNO: C1005X7R1H473K050BB
C38 C40 C54 C56 = jonnew:C: Capacitor; PARTNO: CL05A106MQ5NUNC
C49 = jonnew:C: Capacitor; PARTNO: CL03A105MP3ZSNH
C53 C62 C68 = jonnew:C: Capacitor; PARTNO: GRM033R60J474KE90D
C73 = jonnew:C: Capacitor; PARTNO: CL05A226MQ6ZUN8
D7 = jonnew:LED: Surface mount LED
D35 = jonnew:Z-DIODE: Zener Diode
J69 = jonnew:COAX: COAX CONNECTOR - Edge mount BNC - Vertical BNC - Vertical SMA - etc
JP1 = pinhead:PINHD-2X5: PIN HEADER
L2 L4 L12 L35 = jonnew:L: Inductor
L6 L8 L10 = jonnew:L: Inductor; PARTNO: BLM15PX601SN1D
R10 R25 R27 R30 R33 R35 R37-R41 R43 R44 R54-R57 = jonnew:R: Resistor
SV1 = con-lsta:FE18-2: FEMALE HEADER; OC_FARNELL: unknown; OC_NEWARK: unknown
TP1 TP3 TP4 TP9-TP15 = jonnew:TP: Test pad
U9 = jonnew:DS90UB913A
U13 U15 U17 U20 = jonnew:TLV707
U18 = jonnew:TPS6262X
U19 = jonnew:CRYSTAL-OSC
U$2 = jonnew:CONNFPCBOTTOM45POS0.30MMR/A
U$3 = jonnew:LMK61E2
U$7 = jonnew:10M08SAM153

## Net classes
1 thick: width 0.1 mm
2 diff: width 0.076 mm, drill 0.1 mm, clearance 0.051 mm